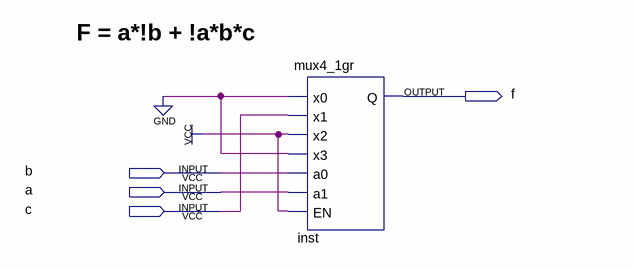
[diagram p0: schematic sheet]
// Quartus schematic log1.bdf as structural Verilog: 1 symbols, 4 pins
module log1 (
  input  b,
  input  a,
  input  c,
  output f
);

  mux4_1gr inst (.x0(1'b0), .x1(c), .x2(1'b1), .x3(1'b0), .a0(b), .a1(a), .EN(1'b1), .Q(f));

  // Notes on the sheet:
  //   F = a*!b + !a*b*c
endmodule
